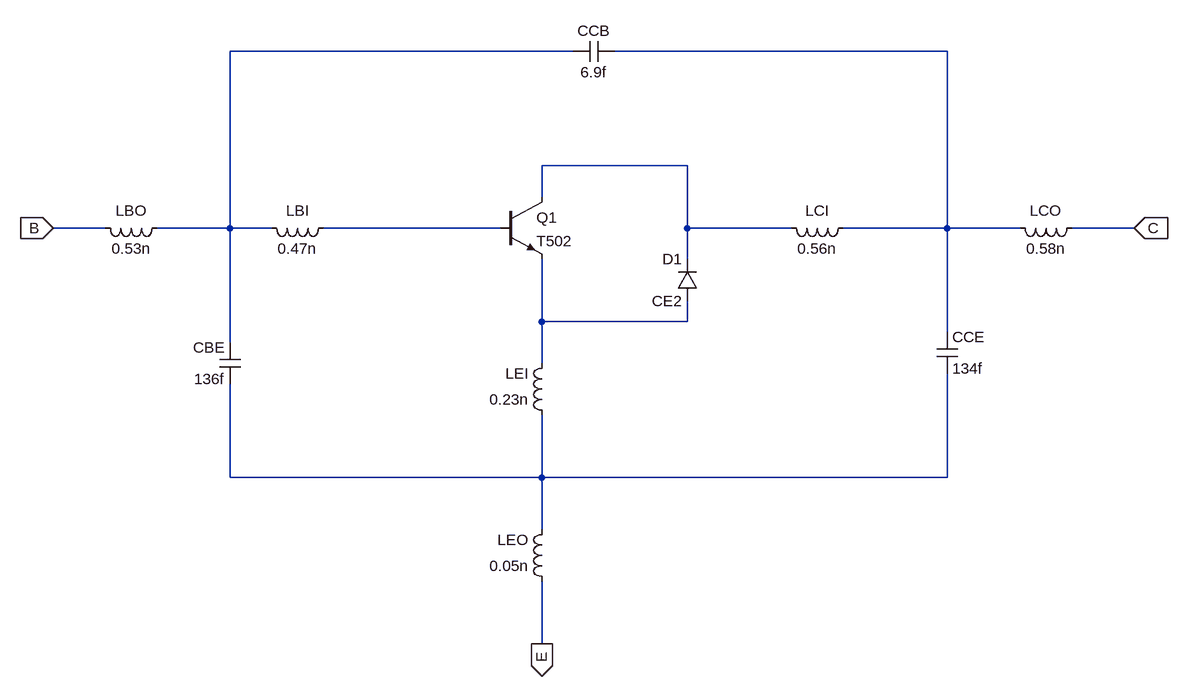
[diagram p0: schematic T502.asc]
T502.asc, the LTspice schematic file:
Version 4
SHEET 1 1260 872
WIRE 320 -112 -208 -112
WIRE 896 -112 384 -112
WIRE 496 64 272 64
WIRE 272 112 272 64
WIRE -400 160 -480 160
WIRE -208 160 -208 -112
WIRE -208 160 -320 160
WIRE -144 160 -208 160
WIRE 208 160 -64 160
WIRE 496 160 496 64
WIRE 656 160 496 160
WIRE 896 160 896 -112
WIRE 896 160 736 160
WIRE 1008 160 896 160
WIRE 1184 160 1088 160
WIRE 496 208 496 160
WIRE 272 304 272 208
WIRE 496 304 496 272
WIRE 496 304 272 304
WIRE 896 320 896 160
WIRE -208 336 -208 160
WIRE 272 368 272 304
WIRE -208 544 -208 400
WIRE 272 544 272 448
WIRE 272 544 -208 544
WIRE 896 544 896 384
WIRE 896 544 272 544
WIRE 272 624 272 544
WIRE 272 800 272 704
FLAG -480 160 B
IOPIN -480 160 In
FLAG 1184 160 C
IOPIN 1184 160 In
FLAG 272 800 E
IOPIN 272 800 Out
SYMBOL npn 208 112 R0
SYMATTR InstName Q1
SYMATTR Value T502
SYMBOL diode 512 272 R180
WINDOW 0 24 64 Left 2
WINDOW 3 24 0 Left 2
SYMATTR InstName D1
SYMATTR Value CE2
SYMBOL ind -48 144 R90
WINDOW 0 5 56 VBottom 2
WINDOW 3 32 56 VTop 2
SYMATTR InstName LBI
SYMATTR Value 0.47n
SYMBOL ind 752 144 R90
WINDOW 0 5 56 VBottom 2
WINDOW 3 32 56 VTop 2
SYMATTR InstName LCI
SYMATTR Value 0.56n
SYMBOL ind -304 144 R90
WINDOW 0 5 56 VBottom 2
WINDOW 3 32 56 VTop 2
SYMATTR InstName LBO
SYMATTR Value 0.53n
SYMBOL ind 1104 144 R90
WINDOW 0 5 56 VBottom 2
WINDOW 3 32 56 VTop 2
SYMATTR InstName LCO
SYMATTR Value 0.58n
SYMBOL ind 288 464 R180
WINDOW 0 36 80 Left 2
WINDOW 3 36 40 Left 2
SYMATTR InstName LEI
SYMATTR Value 0.23n
SYMBOL ind 288 720 R180
WINDOW 0 36 80 Left 2
WINDOW 3 36 40 Left 2
SYMATTR InstName LEO
SYMATTR Value 0.05n
SYMBOL cap 880 320 R0
SYMATTR InstName CCE
SYMATTR Value 134f
SYMBOL cap 384 -128 R90
WINDOW 0 0 32 VBottom 2
WINDOW 3 32 32 VTop 2
SYMATTR InstName CCB
SYMATTR Value 6.9f
SYMBOL cap -192 400 R180
WINDOW 0 24 56 Left 2
WINDOW 3 24 8 Left 2
SYMATTR InstName CBE
SYMATTR Value 136f

The netlist it stands for:
* T502.asc
Q1 N003 N004 N005 0 T502
D1 N005 N003 CE2
LBI N004 N001 0.47n
LCI N002 N003 0.56n
LBO N001 B 0.53n
LCO C N002 0.58n
LEI N006 N005 0.23n
LEO E N006 0.05n
CCE N002 N006 134f
CCB N002 N001 6.9f
CBE N006 N001 136f
.model D D
.lib standard.dio
.model NPN NPN
.model PNP PNP
.lib standard.bjt
.backanno
.end